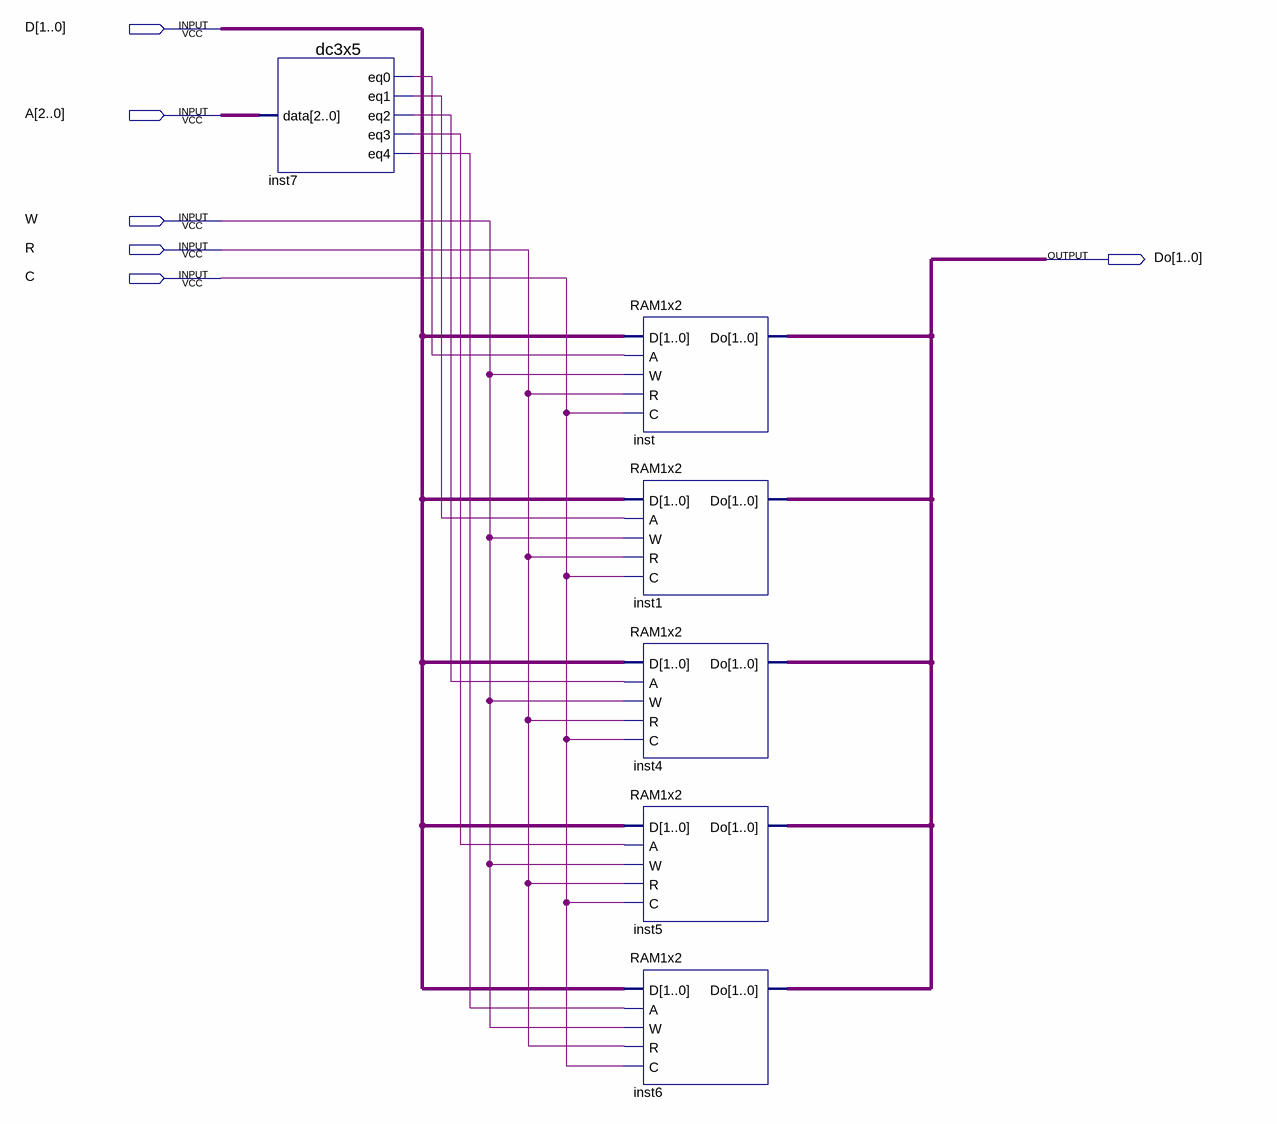
[diagram p0: schematic sheet]
// Quartus schematic RAM5x2.bdf as structural Verilog: 6 symbols, 6 pins
module RAM5x2 (
  input  [1:0] D,
  input  [2:0] A,
  input  W,
  input  R,
  input  C,
  output [1:0] Do
);

  wire inst7_eq0, inst7_eq1, inst7_eq2, inst7_eq3, inst7_eq4;

  dc3x5 inst7 (.data(A), .eq0(inst7_eq0), .eq1(inst7_eq1), .eq2(inst7_eq2), .eq3(inst7_eq3), .eq4(inst7_eq4));
  RAM1x2 inst (.D(D), .A(inst7_eq0), .W(W), .R(R), .C(C), .Do(Do));
  RAM1x2 inst1 (.D(D), .A(inst7_eq1), .W(W), .R(R), .C(C), .Do(Do));
  RAM1x2 inst4 (.D(D), .A(inst7_eq2), .W(W), .R(R), .C(C), .Do(Do));
  RAM1x2 inst5 (.D(D), .A(inst7_eq3), .W(W), .R(R), .C(C), .Do(Do));
  RAM1x2 inst6 (.D(D), .A(inst7_eq4), .W(W), .R(R), .C(C), .Do(Do));
endmodule
